# Altium schematic sheet fonte_chaveada.SchDoc
size A4
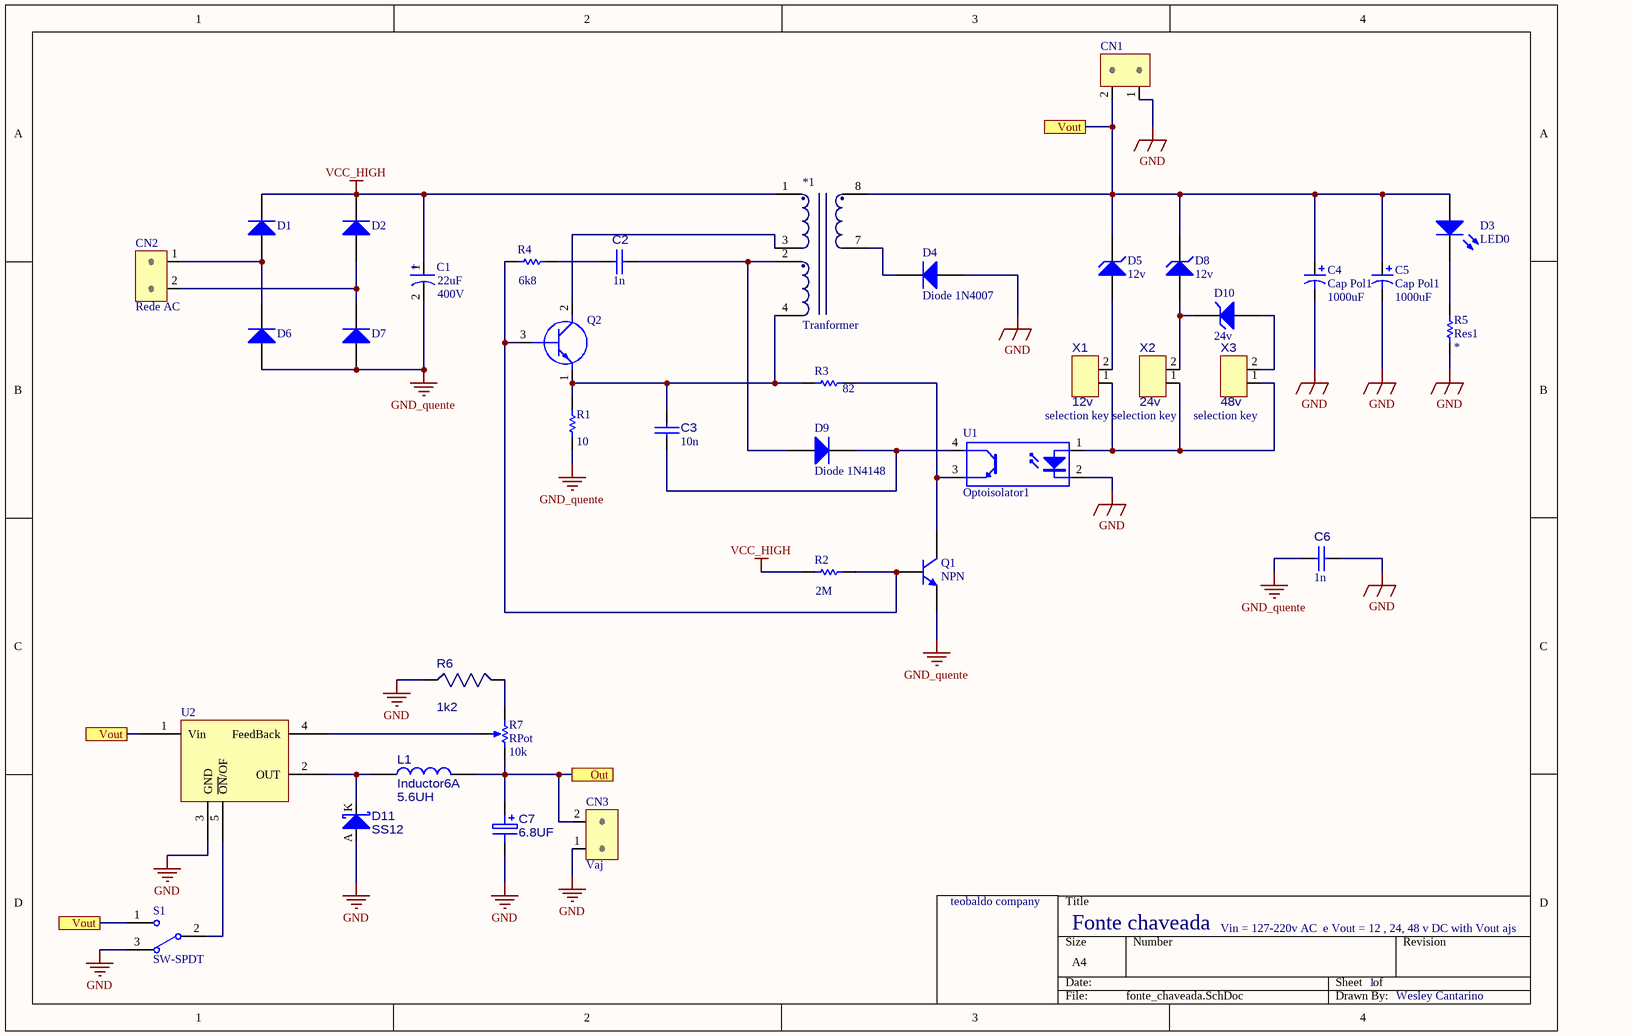
[diagram p0: fonte_chaveada.SchDoc]

## Parts
*1  Tranformer  [DIV_TRAFO PLC]
C1  value 22uF  Tensão: 400V  [CAP_ALU_RADIAL_7.5mm]  (hidden comment: Electrolytic Capacitor)
C2  1n  [CAP_CER_RADIAL_3.5MM]
C3  10n  [CAP_CER_RADIAL_3.5MM]
C4  Cap Pol1  value 1000uF  [RB7.6-15]
C5  Cap Pol1  value 1000uF  [RB7.6-15]
C6  1n  [CAP_CER_RADIAL_3.5MM]
C7  6.8UF  [RADPOL8X11]
CN1  Vout  [MKDSN02]  (value not drawn)
CN2  Rede AC  [MKDSN02]
CN3  Vaj  [CN_KRE_2]
D1  Diode 1N4007  [DO-41]  (value not drawn)
D2  Diode 1N4007  [DO-41]  (value not drawn)
D3  LED0  [LED-0]
D4  Diode 1N4007  [DO-41]
D5  12v  [DIO_PTH_5MM]
D6  Diode 1N4007  [DO-41]  (value not drawn)
D7  Diode 1N4007  [DO-41]  (value not drawn)
D8  12v  [DIO_PTH_5MM]
D9  Diode 1N4148  [DO-41]
D10  24v  [DIO_PTH_5MM]
D11  value SS12  [DIO_PTH_5MM]  (hidden comment: DIODE - SCHOTTKY)
L1  5.6UH  [Inductor6A]
Q1  NPN  [TO-226-AA]
Q2  BD135  [TO239P266X762X1345-3P]  (value not drawn)
R1  value 10  [AXIAL-0.3]  (hidden comment: Res1)
R2  value 2M  [AXIAL-0.3]  (hidden comment: Res1)
R3  value 82  [AXIAL-0.3]  (hidden comment: Res1)
R4  value 6k8  [AXIAL-0.3]  (hidden comment: Res1)
R5  Res1  [AXIAL-0.3]
R6  1k2  [RES-7.62mm]
R7  RPot  value 10k  [CN_KRE_3]
S1  SW-SPDT  [Pin Header 3 Ways]
U1  Optoisolator1  [DIP-4]
U2  LM2576HV 5.0  [LM2576-TO220]  (value not drawn)
X1  Footprint: 12v  [HEADER_1X2]  (hidden comment: selection key)
X2  Footprint: 24v  [HEADER_1X2]  (hidden comment: selection key)
X3  Footprint: 48v  [HEADER_1X2]  (hidden comment: selection key)

## Ports
Out, Vout

## Nets
GND: C4.2 C5.2 C6.1 C7.2 CN1.1 CN3.1 D4.1(A) D11.A R5.1 R6.1 S1.3 U1.2(K) U2.3(GND)
GND_quente: C1.2 C6.2 D6.1(A) D7.1(A) Q1.3(E) R1.2
VCC_HIGH: *1.1 C1.1 D1.2(K) D2.2(K) R2.2
Out: C7.1 CN3.2 L1.2 R7.2(BOT) ; port Out
Vout: *1.8 C4.1 C5.1 CN1.2 D3.1(A) D5.2(K) D8.2(K) S1.1 U2.1(Vin) ; port Vout
Net*1_2: *1.2 C2.2 D9.1(A)
Net*1_3: *1.3 Q2.2(C)
Net*1_4: *1.4 C3.2 Q2.1(E) R1.1 R3.2
Net*1_7: *1.7 D4.2(K)
NetC2_1: C2.1 R4.2
NetC3_1: C3.1 D9.2(K) U1.4(C)
NetCN2_1: CN2.1 D1.1(A) D6.2(K)
NetCN2_2: CN2.2 D2.1(A) D7.2(K)
NetD3_2: D3.2(K) R5.2
NetD5_1: D5.1(A) X1.2
NetD8_1: D8.1(A) D10.2(K) X2.2
NetD10_1: D10.1(A) X3.2
NetD11_K: D11.K L1.1 U2.2(OUT)
NetQ1_1: Q1.1(C) R3.1 U1.3(E)
NetQ1_2: Q1.2(B) Q2.3(B) R2.1 R4.1
NetR6_2: R6.2 R7.1(TOP)
NetR7_3: R7.3(TAP) U2.4(FeedBack)
NetS1_2: S1.2 U2.5(~{ON}/OF)
NetU1_1: U1.1(A) X1.1 X2.1 X3.1

## Notes on the sheet
- teobaldo company
- Fonte chaveada
- Vin = 127-220v AC  e Vout = 12 , 24, 48 v DC with Vout ajs
- 1
- Wesley Cantarino
- (in symbol CAP_ALU_RADIAL_7.5MM) +

## Library data of the parts
*1 = Tranformer PLC: Supplier 1: Digi-Key; Supplier Part Number 1: 1297-1074-ND
C1 = CAP_ALU_RADIAL_7.5MM: PTH Radial Electrolytic Capacitor
C2 C3 C6 = CAP_CER_RADIAL_3.5MM: PTH Radial Ceramic Capacitor; Tensão: ?
  C2 C6: Value: 1n
  C3: Value: 10n
C4 C5 = Cap Pol1: Polarized Capacitor (Radial); Published: 8-Jun-2000; LatestRevisionDate: 17-Jul-2002; LatestRevisionNote: Re-released for DXP Platform.; PackageReference: RB7.6-15; Publisher: Altium Limited; PackageDescription: Polarized Capacitor (Radial); 2 Leads
C7 = ELECTRO1_1: Value: 6.8UF
CN1 CN2 = CN_2: MKDS; Value: MKDS; Digikey: 277-5893-ND; Footprint: MKDSN02 2.54pitch
CN3 = CN_MKDS_2: MKDS_2; Value: ?
D1 D2 D4 D6 D7 D9 = Diode 1N4007: 1 Amp General Purpose Rectifier; Published: 8-Jun-2000; LatestRevisionDate: 17-Jul-2002; LatestRevisionNote: Re-released for DXP Platform.; DatasheetVersion: 1998; PackageVersion: Aug-1999; PackageReference: DO-41; Publisher: Altium Limited; PackageDescription: Diode, Axial; Body 5.2 x 2.7 mm (LxDia. max), Lead Dia. 0.86 mm (max); Code_JEDEC: DO-204-AL; ComponentLink1Description: Manufacturer Link; ComponentLink1URL: http://www.fairchildsemi.com/; ComponentLink2Description: Datasheet; ComponentLink2URL: http://www.fairchildsemi.com/ds/1N%2F1N4001.pdf
D3 = LED0: Typical INFRARED GaAs LED; Published: 8-Jun-2000; LatestRevisionDate: 08-Jul-2005; LatestRevisionNote: Mech Layer 1 removed.; PackageReference: LED-0; Publisher: Altium Limited; PackageDescription: LED; 2 Leads
D5 D8 D10 = D Zener: Zener Diode; pin to pad: 1>A 2>K; Published: 8-Jun-2000; LatestRevisionDate: 17-Jul-2002; LatestRevisionNote: Re-released for DXP Platform.; PackageReference: DIODE-0.7; Publisher: Altium Limited; PackageDescription: Diode, Thru-Hole; 2 Leads; 0.7 in Pin Spacing
D11 = DIODE - SCHOTTKY: Schottky Diode; Digikey part number: SS12E-TPMSCT-ND; Digikey price 1x: 0.70; Digikey price 100x: 0.224
L1 = IND_1: FIXED IND 5.6UH 6A 14.4 MOHM SMD; ClassName: REG_3; Digikey: 732-4107-1-ND; Value: 5.6UH
Q1 = NPN: NPN Bipolar Transistor; Published: 8-Jun-2000; LatestRevisionDate: 17-Jul-2002; LatestRevisionNote: Re-released for DXP Platform.; PackageReference: TO-226-AA; Publisher: Altium Limited; PackageDescription: TO, Flat Index; 3 In-Line, Axial Leads; Body Dia. 4.8mm; Leads 0.55 x 0.51 mm (max); Code_JEDEC: TO-226-AA
Q2 = BD135: Transistor BJT NPN; Manufacturer_Name: ON Semiconductor; Datasheet Link: http://uk.rs-online.com/web/p/products/3489490; Height: 2.66mm; Manufacturer_Part_Number: BD135; Mouser Part Number: 863-BD135; Mouser Price/Stock: https://www.mouser.com/Search/Refine.aspx?Keyword=863-BD135; RS Part Number: 3489490; RS Price/Stock: http://at.rs-online.com/web/p/products/3489490
R1-R5 = Res1: Resistor; Published: 8-Jun-2000; LatestRevisionDate: 17-Jul-2002; LatestRevisionNote: Re-released for DXP Platform.; PackageReference: AXIAL-0.3; Publisher: Altium Limited; PackageDescription: Axial Device, Thru-Hole; 2 Leads; 0.3 in Pin Spacing
  R5: Value: *
R6 = RES_PTH300: Pin Through Hole Resistor 300mils/7.62mm; Footprint: RES_PTH300; Value: 1k2
R7 = RPot: Potentiometer; Sim Note: Enter the Resistance value and the set point into parameter fields.; Set Position: 0.5; Published: 8-Jun-2000; LatestRevisionDate: 17-Jul-2002; LatestRevisionNote: Re-released for DXP Platform.; PackageReference: VR5; Publisher: Altium Limited; PackageDescription: Variable Resistor, Thru-Hole; 3 Leads
S1 = SW-SPDT: SPDT Subminiature Toggle Switch, Right Angle Mounting, Vertical Actuation; Published: 24-Mar-1999; LatestRevisionDate: 17-Dec-2003; LatestRevisionNote: Schematic revised, PCB Footprint replaced.; DatasheetVersion: 05-Dec-2000; PackageReference: TL36WW15050; Publisher: Altium Limited; PackageDescription: Switch; 4 Leads; ComponentLink1Description: Manufacturer Link; ComponentLink1URL: http://www.apem.com
U1 = Optoisolator1: 4-Pin Phototransistor Optocoupler; Published: 24-Mar-1999; LatestRevisionDate: 04-Mar-2005; LatestRevisionNote: Sch pins 3 & 4 Swapped.; DatasheetVersion: Nov-2003; PackageReference: DIP-4; Publisher: Altium Limited
U2 = LM2576
X1-X3 = HEADER_1X2: 1X2; Value: selection key